# EAGLE design chicken_door_h_bridge (EAGLE 5.11)
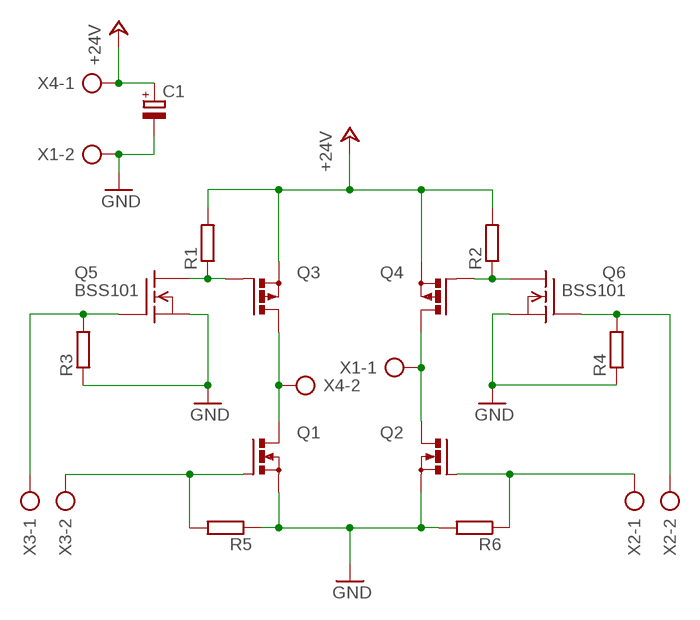
[diagram p0: schematic, sheet 1]

## Parts
C1  CPOL-EUE5-8.5  [E5-8,5]
Q1  PMOSFET_NTO220BV  [TO220BV]
Q2  PMOSFET_NTO220BV  [TO220BV]
Q3  PMOSFET_PTO220BV  [TO220BV]
Q4  PMOSFET_PTO220BV  [TO220BV]
Q5  BSS101  [TO92]
Q6  BSS101  [TO92]
R1  R-EU_0204/5  [0204/5]
R2  R-EU_0204/5  [0204/5]
R3  R-EU_0204/5  [0204/5]
R4  R-EU_0204/5  [0204/5]
R5  R-EU_0204/5  [0204/5]
R6  R-EU_0204/5  [0204/5]
X1  AK500/2  [AK500/2]
X2  AK500/2  [AK500/2]
X3  AK500/2  [AK500/2]
X4  AK500/2  [AK500/2]

## Nets
+24V: C1.+ Q3.S Q4.S R1.2 R2.2 X4.1
GND: C1.- Q1.S Q2.S Q5.1(S) Q6.1(S) R3.1 R4.1 R5.1 R6.2 X1.2
N$1: Q1.D Q3.D X4.2
N$2: Q2.D Q4.D X1.1
N$4: Q4.G Q6.3(D) R2.1
N$5: Q1.G R5.2 X3.2
N$6: Q2.G R6.1 X2.1
N$7: Q3.G Q5.3(D) R1.1
N$9: Q5.2(G) R3.2 X3.1
N$11: Q6.2(G) R4.2 X2.2

## Library data of the parts
C1 = rcl:CPOL-EU: POLARIZED CAPACITOR, European symbol
Q1 Q2 = transistor-power:PMOSFET_N: Power MOSFET N-Channel
Q3 Q4 = transistor-power:PMOSFET_P: Power MOSFET P-Channel
Q5 Q6 = transistor-fet:BSS101: N-Channel Enhancement MOSFET 200V; 0,16A; 11Ohm
R1-R6 = resistor:R-EU_: RESISTOR, European symbol
X1-X4 = con-ptr500:AK500/2: CONNECTOR; OC_FARNELL: unknown; OC_NEWARK: unknown

## Board
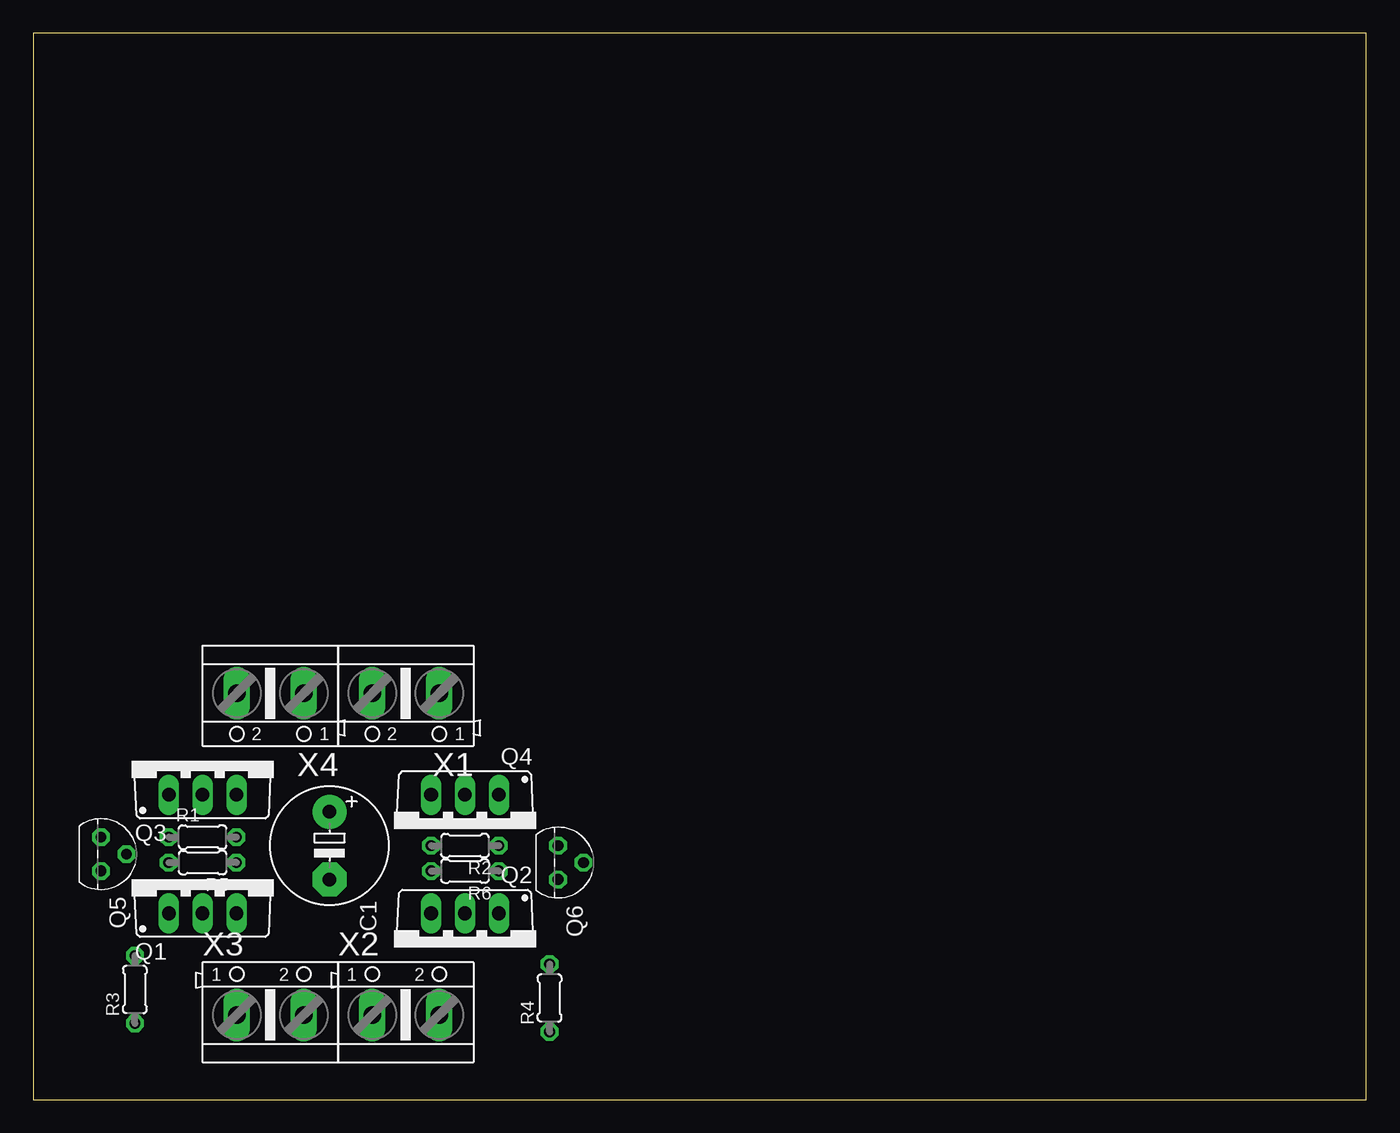
[diagram p1: board, top side]
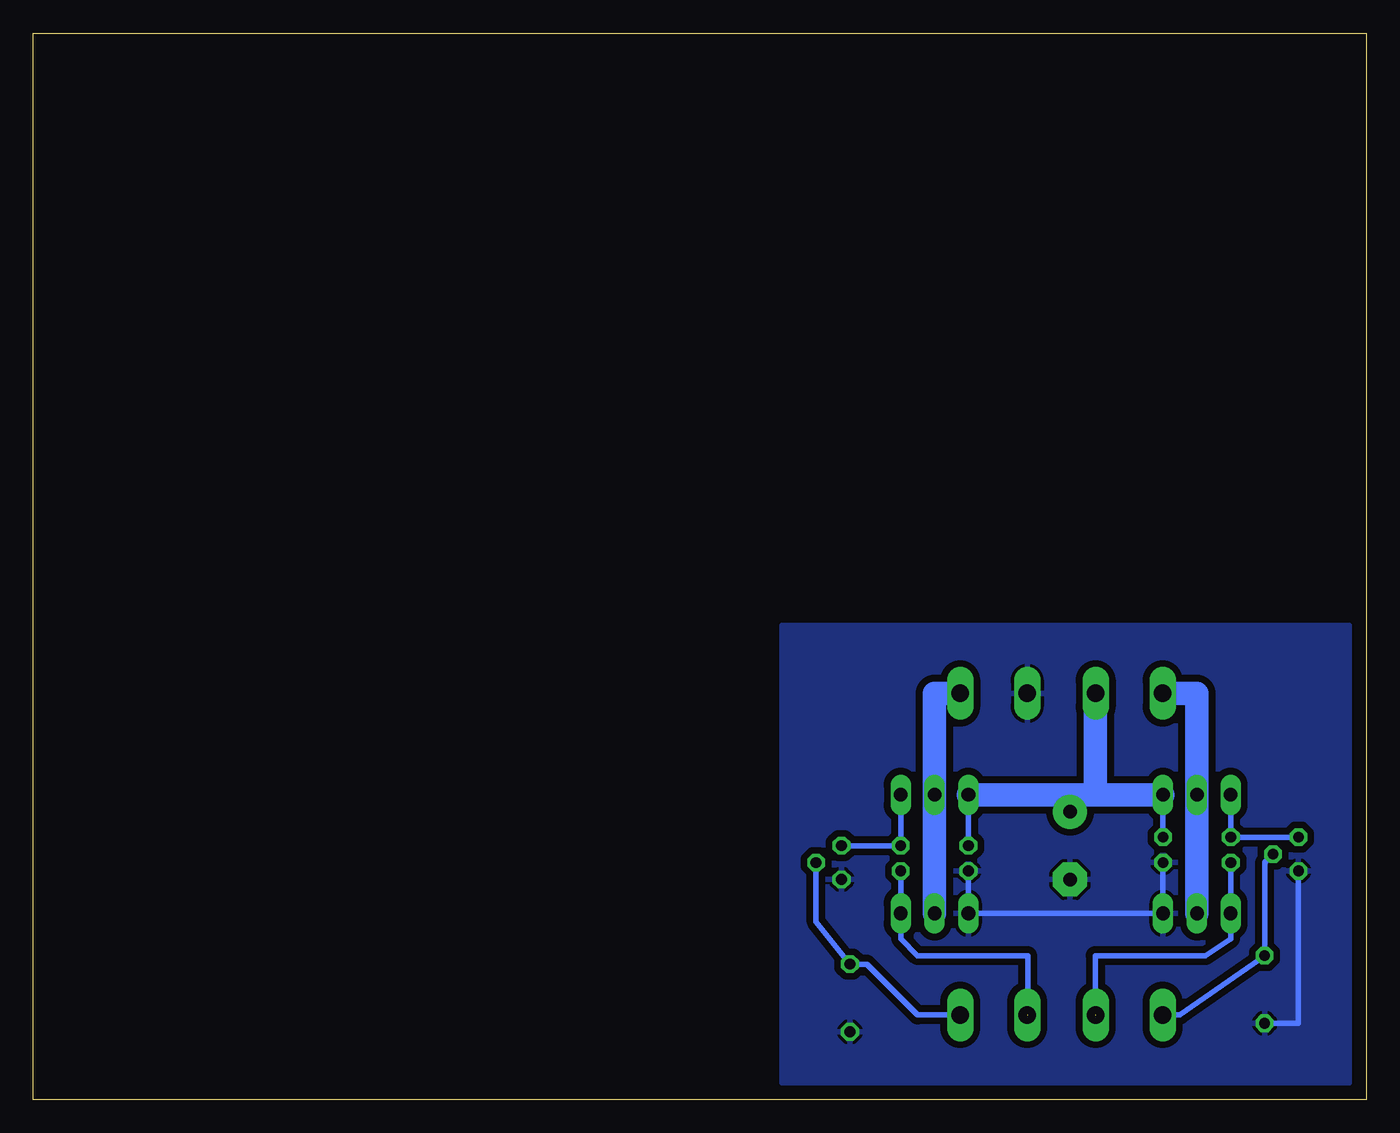
[diagram p2: board, bottom side, seen from below]

Size 100 x 80 mm. Coordinates in mm from the lower left corner, seen from the top.
Outline: 0,0 100,0 100,80 0,80 0,0
Copper layers (1*16): Top 0.035mm / dielectric 1.5mm / Bottom 0.035mm
Design rules "default *": minimum track width 10mil, minimum drill 24mil, track to track 20mil, track to pad 20mil, pad to pad 8mil, via to via 8mil, smd to smd 8mil, copper to edge 40mil, drill to drill 8mil, minimum pad ring 10mil, minimum via ring 8mil, stop-mask expansion 4mil, vias tented up to drill 0mil, thermal gap 10mil

### Footprints (pad centres in the part's own frame; a part is rotated, then mirrored left to right if it is on the bottom)
E5-8,5 = drill 1.016 pad 2.54 round: + -2.54,0 | drill 1.016 pad 2.54 octagon: - 2.54,0
TO220BV = drill 1.016 long: D 0,-2.54; G -2.54,-2.54; S 2.54,-2.54
TO92 = drill 0.813 octagon: 1 1.27,0; 2 0,1.905; 3 -1.27,0
0204/5 = drill 0.813 octagon: 1 -2.54,0; 2 2.54,0
AK500/2 = drill 1.321 long: 1 -2.515,0; 2 2.515,0

### Placement (x,y rotation side)
C1  22.23,19.05 270 top
Q1  12.7,16.51 0 top
Q2  32.38,11.43 180 top
Q3  12.7,25.4 0 top
Q4  32.38,20.32 180 top
Q5  5.08,18.41 270 top
Q6  39.37,17.78 270 top
R1  12.7,19.68 0 top
R2  32.38,19.05 180 top
R3  7.62,8.26 90 top
R4  38.73,7.62 90 top
R5  12.7,17.78 180 top
R6  32.38,17.14 180 top
X1  27.94,30.48 180 top
X2  27.94,6.35 0 top
X3  17.78,6.35 0 top
X4  17.78,30.48 180 top

### Tracks (layer width: path | path; a pad name or v marks a point on that pad's centre or on a via)
+24V
  Bottom 0.254: X4.1 20.32,30.48 20.95,30.48 | 22.23,22.86 C1.+
  Bottom 0.406: R1.2 Q3.S | Q4.S R2.2
  Bottom 1.778: Q3.S 20.32,22.86 | 20.32,22.86 22.23,22.86 Q4.S | 20.32,22.86 20.32,30.48
GND
  Bottom 0.406: R3.1 5.08,5.71 Q5.1 | R5.1 Q1.S Q2.S R6.2
  pour Bottom: 1.27,35.56 1.27,1.27 43.81,1.27 43.81,35.56
N$1
  Bottom 0.254: 15.88,30.48 X4.2 15.24,30.48
  Bottom 1.778: Q1.D Q3.D 12.7,30.48 15.24,30.48
N$2
  Bottom 0.406: 31.11,30.48 30.48,30.48
  Bottom 1.778: Q2.D Q4.D 32.38,30.48 31.11,30.48 X1.1
N$4
  Bottom 0.406: Q6.3 R2.1 Q4.G
N$5  (1 unrouted)
  Bottom 0.406: R5.2 Q1.G 10.16,12.06 12.06,10.79 20.32,10.79 20.32,6.35
N$6  (1 unrouted)
  Bottom 0.406: R6.1 Q2.G 34.92,12.06 33.66,10.79 25.4,10.79 25.4,6.35
N$7
  Bottom 0.406: Q5.3 R1.1 Q3.G
N$9
  Bottom 0.254: 14.61,6.35 X3.1
  Bottom 0.406: 15.24,6.35 14.61,6.35 13.97,6.35 R3.2 7.62,17.78 Q5.2
N$11
  Bottom 0.254: X2.2 31.11,6.35
  Bottom 0.406: Q6.2 41.27,13.34 R4.2 37.47,10.16 33.66,6.35 31.11,6.35 30.48,6.35